# EAGLE design complete (EAGLE 6.5.0)
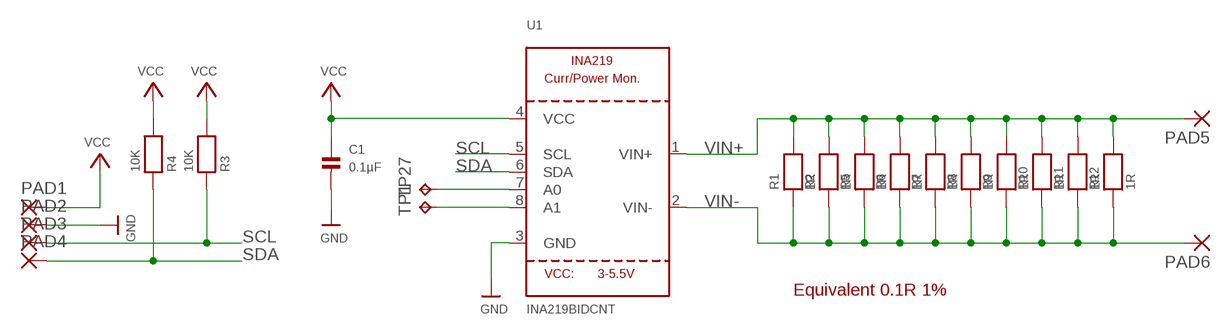
[diagram p0: schematic, sheet 1]

## Parts
C1  0.1µF  CAP_CERAMIC0805  [0805]
PAD1  SMD2  [SMD1,27-2,54]
PAD2  SMD2  [SMD1,27-2,54]
PAD3  SMD2  [SMD1,27-2,54]
PAD4  SMD2  [SMD1,27-2,54]
PAD5  SMD2  [SMD1,27-2,54]
PAD6  SMD2  [SMD1,27-2,54]
R1  1R  RESISTOR1206  [1206]
R2  1R  RESISTOR1206  [1206]
R3  10K  RESISTOR0805  [0805]
R4  10K  RESISTOR0805  [0805]
R5  1R  RESISTOR1206  [1206]
R6  1R  RESISTOR1206  [1206]
R7  1R  RESISTOR1206  [1206]
R8  1R  RESISTOR1206  [1206]
R9  1R  RESISTOR1206  [1206]
R10  1R  RESISTOR1206  [1206]
R11  1R  RESISTOR1206  [1206]
R12  1R  RESISTOR1206  [1206]
TP1  TPTP06R  [TP06R]
TP27  TPTP06R  [TP06R]
U1  INA219BIDCNT  INA219  [SOT23-8]

## Nets
GND: C1.2 PAD2.1(P) U1.3(GND)
N$1: TP27.TP U1.7(A0)
N$2: TP1.TP U1.8(A1)
SCL: PAD3.1(P) R3.1 U1.5(SCL)
SDA: PAD4.1(P) R4.1 U1.6(SDA)
VCC: C1.1 PAD1.1(P) R3.2 R4.2 U1.4(VCC)
VIN+: PAD5.1(P) R1.2 R2.2 R5.2 R6.2 R7.2 R8.2 R9.2 R10.2 R11.2 R12.2 U1.1(VIN+)
VIN-: PAD6.1(P) R1.1 R2.1 R5.1 R6.1 R7.1 R8.1 R9.1 R10.1 R11.1 R12.1 U1.2(VIN-)

## Notes on the sheet
- Equivalent 0.1R 1%

## Library data of the parts
C1 = microbuilder:CAP_CERAMIC: Ceramic Capacitors 0402 - 0402 Surface Mount Capacitors 16pF 50V 5% [Digikey: 445-4899-2-ND] 18pF 50V 5% [Digikey: 490-1281-2-ND] 22pF 50V 5% [Digikey: 490-1283-2-ND] 68pF 50V 5% [Digikey: 490-1289-2-ND] 0.1uF 10V 10% [Digikey: 490-1318-2-ND] 1.0uF 6.3V 10% [Digikey: 490-1320-2-ND] 0603 - 0603 Surface Mount Capacitors 16 pF 50V 5% [Digikey: 445-5051-2-ND] 22 pF 50V [Digikey: PCC220ACVTR-ND] 33 pF 50V 5% [Digikey: 490-1415-1-ND] 56pF 50V 5% [Digikey: 490-1421-1-ND] 220pF 50V 5% [Digikey: 445-1285-1-ND] 680 pF 50V 2200 pF 50V 5% C0G [Digikey: 445-1297-1-ND] 5600 pF 100V 5% X7R [Digikey: 478-3711-1-ND] 0.1 µF 25V 10% [Digikey: PCC2277TR-ND] 0.22 µF 16V 10% X7R [Digikey: 445-1318-1-ND] 1.0 µF 25V 10% [Digikey: 445-5146-2-ND] 0603 - RF Specific 3pF 250V +/-0.1pF RF [Digikey: 712-1347-1-ND] 18 pF 250V 5% [Digikey: 478-3505-1-ND or 712-1322-1-ND] 56 pF 250V 5% C0G RF [Digikey: 490-4867-1-ND] 68 pF 250V RF [Digikey: 490-4868-1-ND] 0805 - 0805 Surface Mount Capacitors 220 pF 250V 2% RF Ceramic Capacitor [Digikey: 712-1398-1-ND] 1000 pF 50V 2% NP0 Ceramic Capacitor [Digikey: 478-3760-1-ND] 0.1 µF 25V 10% Ceramic Capacitor [Digikey: PCC1828TR-ND] 1.0 µF 16V 10% Ceramic Capacitor[Digikey: 490-1691-2-ND] 10.0 µF 10V 10% Ceramic Capacitor[Digikey: 709-1228-1-ND] 10.0 uF 16V 10% Ceramic Capacitor [Digikey: 478-5165-2-ND] 47 uF 6.3V 20% Ceramic Capacitor [Digikey: 587-1779-1-ND or 399-5506-1-ND] 1206 - 1206 Surface Mount Capacitors 47uF 10V 20% Ceramic Capacitor [Digikey: 490-5528-1-ND or 399-5508-1-ND or 445-6010-1-ND] 100uF 6.3V -20%, +80% Y5V Ceramic Capacitor (Digikey: 490-4512-1-ND, Mouser: 81-GRM31CF50J107ZE1L)
PAD1-PAD6 = wirepad:SMD2: SMD PAD
R1-R12 = microbuilder:RESISTOR: Resistors 0402 - 0402 Surface Mount Package 22 Ohm 1% 1/16W [Digikey: 311-22.0LRTR-ND] 33 Ohm 5% 1/16W 1.0K 5% 1/16W 1.5K 5% 1/16W 2.0K 1% 1/16W 10.0K 1% 1/16W [Digikey: 311-10.0KLRTR-ND] 10.0K 5% 1/16W [Digikey: RMCF0402JT10K0TR-ND] 12.1K 1% 1/16W [Digikey: 311-22.0LRTR-ND] 100.0K 5% 1/16W 0603 - 0603 Surface Mount Package 0 Ohm 1/10 Watt 1% Resistor 15 Ohm 1/10 Watt 1% Resistor 33 Ohm 1/10 Watt 1% Resistor 49.9 Ohm 1/10 Watt 1% Resistor 100 Ohm 1/10 Watt 1% Resistor 150 Ohm 1/10 Watt 1% Resistor 240 Ohm 1/10 Watt 1% Resistor 390 Ohm 1/10 Watt 1% Resistor 560 Ohm 1/10 Watt 1% Resistor 680 Ohm 1/10 Watt 1% Resistor 750 Ohm 1/10 Watt 1% Resistor 1.0K Ohm 1/10 Watt 1% Resistor 1.5K Ohm 1/10 Watt 1% Resistor 2.0K Ohm 1/10 Watt 1% Resistor 2.2K Ohm 1/10 Watt 1% Resistor 3.3K Ohm 1/10 Watt 1% Resistor 4.7K Ohm 1/10 Watt 1% Resistor 10.0K Ohm 1/10 Watt 1% Resistor 12.0K Ohm 1/10 Watt 1% Resistor 12.1K Ohm 1/10 Watt 1% Resistor 20.0K Ohm 1/10 Watt 1% Resistor 33.0K Ohm 1/10 Watt 1% Resistor 100.0K Ohm 1/10 Watt 1% Resistor 0805 - 0805 Surface Mount Package 0 Ohm 1/8 Watt 1% Resistor 33 Ohm 1/8 Watt 1% Resistor 100 Ohm 1/8 Watt 1% Resistor 150 Ohm 1/8 Watt 1% Resistor 200 Ohm 1/8 Watt 1% Resistor 240 Ohm 1/8 Watt 1% Resistor 330 Ohm 1/8 Watt 1% Resistor 390 Ohm 1/8 Watt 1% Resistor 470 Ohm 1/8 Watt 1% Resistor 1.0K Ohm 1/8 Watt 1% Resistor 1.5K Ohm 1/8 Watt 1% Resistor 2.0K Ohm 1/8 Watt 1% Resistor 4.7K Ohm 1/8 Watt 1% Resistor 5.1K Ohm 1/8 Watt 1% Resistor 5.6K Ohm 1/8 Watt 1% Resistor 10.0K Ohm 1/8 Watt 1% Resistor 22.0K Ohm 1/8 Watt 1% Resistor 33.0K Ohm 1/8 Watt 1% Resistor 100K Ohm 1/8 Watt 1% Resistor 1206 - 1206 Surface Mount Package 2012 - 2010 Surface Mount Package 0.11 Ohm 1/2 Watt 1% Resistor - Digikey: RHM.11UCT-ND
TP1 TP27 = testpad:TP: Test pad
U1 = microbuilder:INA219: INA219 - I2C Current/Power Monitor Voltage Range: 0-26V Accuracy: 0.5% Temperature: -40°C - 125°C

## Board
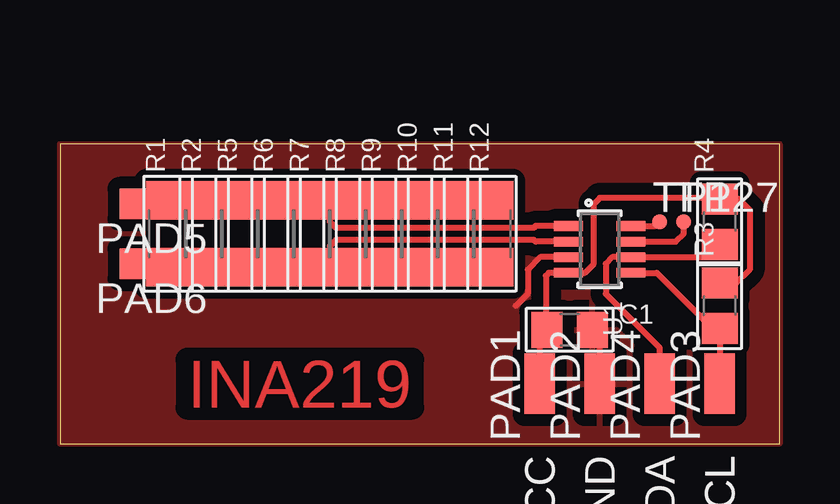
[diagram p1: board, top side]
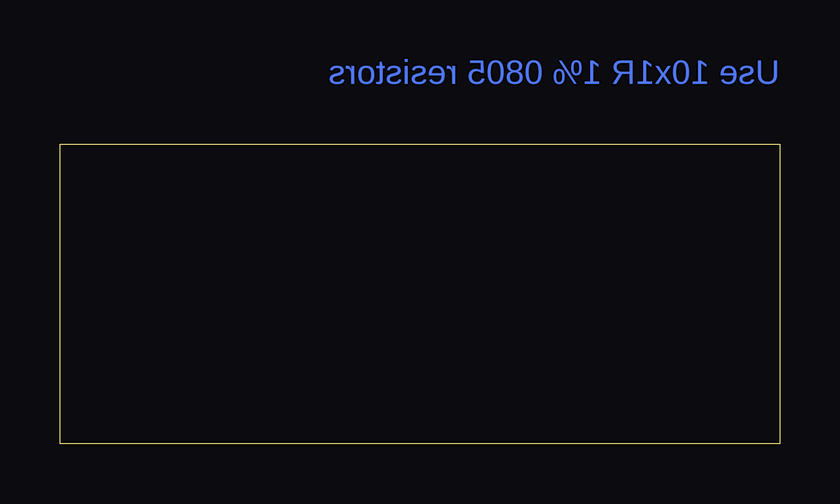
[diagram p2: board, bottom side, seen from below]

Size 30 x 12.5 mm. Coordinates in mm from the lower left corner, seen from the top.
Outline: 0,0 30,0 30,12.5 0,12.5 0,0
Copper layers (1*16): Top 0.035mm / dielectric 1.5mm / Bottom 0.035mm
Design rules "default *": minimum track width 10mil, minimum drill 24mil, track to track 8mil, track to pad 8mil, pad to pad 8mil, via to via 8mil, smd to smd 8mil, copper to edge 0mil, drill to drill 8mil, minimum pad ring 10mil, minimum via ring 8mil, stop-mask expansion 4mil, vias tented up to drill 0mil, thermal gap 0.5mm

### Footprints (pad centres in the part's own frame; a part is rotated, then mirrored left to right if it is on the bottom)
0805 = smd 1.3 x 1.5: 1 -0.95,0; 2 0.95,0
SMD1,27-2,54 = smd 1.27 x 2.54: 1 0,0
1206 = smd 1.6 x 1.8: 1 -1.4,0; 2 1.4,0
TP06R = smd 0.6 x 0.6: TP 0,0
SOT23-8 = smd 0.4 x 1.2: 1 -0.975,-1.3; 2 -0.325,-1.3; 3 0.325,-1.3; 4 0.975,-1.3; 5 0.975,1.3; 6 0.325,1.3; 7 -0.325,1.3; 8 -0.975,1.3

### Placement (x,y rotation side)
C1  21.25,4.75 0 top
PAD1  20,2.5 0 top
PAD2  22.5,2.5 0 top
PAD3  27.5,2.5 0 top
PAD4  25,2.5 0 top
PAD5  3.75,10 90 top
PAD6  3.75,7.5 90 top
R1  4.5,8.75 90 top
R2  6,8.75 90 top
R3  27.5,5.75 90 top
R4  27.5,9.25 90 top
R5  7.5,8.75 90 top
R6  9,8.75 90 top
R7  10.5,8.75 90 top
R8  12,8.75 90 top
R9  13.5,8.75 90 top
R10  15,8.75 90 top
R11  16.5,8.75 90 top
R12  18,8.75 90 top
TP1  25,9.25 0 top
TP27  26,9.25 0 top
U1  22.5,8.1 270 top

### Tracks (layer width: path | path; a pad name or v marks a point on that pad's centre or on a via)
GND
  Top 0.25: PAD2.1 22.5,4.45 C1.2 | U1.3 20.02,7.78 19.5,7.25 19.5,6.25 19,5.75
  pour Top (isolate 0.5): 0,12.5 30,12.5 30,0 0,0
N$1
  Top 0.25: U1.7 25.68,8.43 26,8.75 TP27.TP
N$2
  Top 0.25: U1.8 24.82,9.07 TP1.TP
SCL
  Top 0.25: PAD3.1 R3.1 27.3,5 27,5 24.88,7.12 U1.5
SDA
  Top 0.25: R4.1 26.98,7.78 U1.6 23.02,7.78 22.75,7.5 22.75,6.25 25,4 PAD4.1
VCC
  Top 0.25: PAD1.1 20,4.45 C1.1 20.25,4.8 20.25,7 20.38,7.12 U1.4 21.88,7.12 22.25,7.5 22.25,10 22.5,10.25 27.5,10.25 R4.2 28.3,10.2 28.75,9.75 28.75,7.25 28.2,6.7 R3.2
VIN+
  Top 0.25: U1.1 19.82,9.07 19.75,9 11.5,9 11.25,9.25 11.25,10 10.65,10 R7.2 | PAD5.1 4.35,10 R1.2 R2.2 R5.2 R6.2 R7.2 | R7.2 R8.2 R9.2 R10.2 R11.2 R12.2
VIN-
  Top 0.25: U1.2 19.82,8.43 19.75,8.5 11.5,8.5 11.25,8.25 11.25,7.5 | 11.25,7.5 11,7.25 10.6,7.25 R7.1 R6.1 R5.1 R2.1 R1.1 3.9,7.35 PAD6.1 | R12.1 R11.1 | R11.1 16.1,7.35 16,7.25 16.4,7.25 R11.1 | R11.1 R10.1 R9.1 | R9.1 12.85,7.35 12.75,7.25 13.4,7.25 R9.1 | R9.1 12.6,7.35 12.5,7.25 12.1,7.25 R8.1 11.4,7.35 11.25,7.5

### Text on the board
Top: INA219
Bottom: Use 10x1R 1% 0805 resistors
tPlace: VCC | GND | SDA | SCL